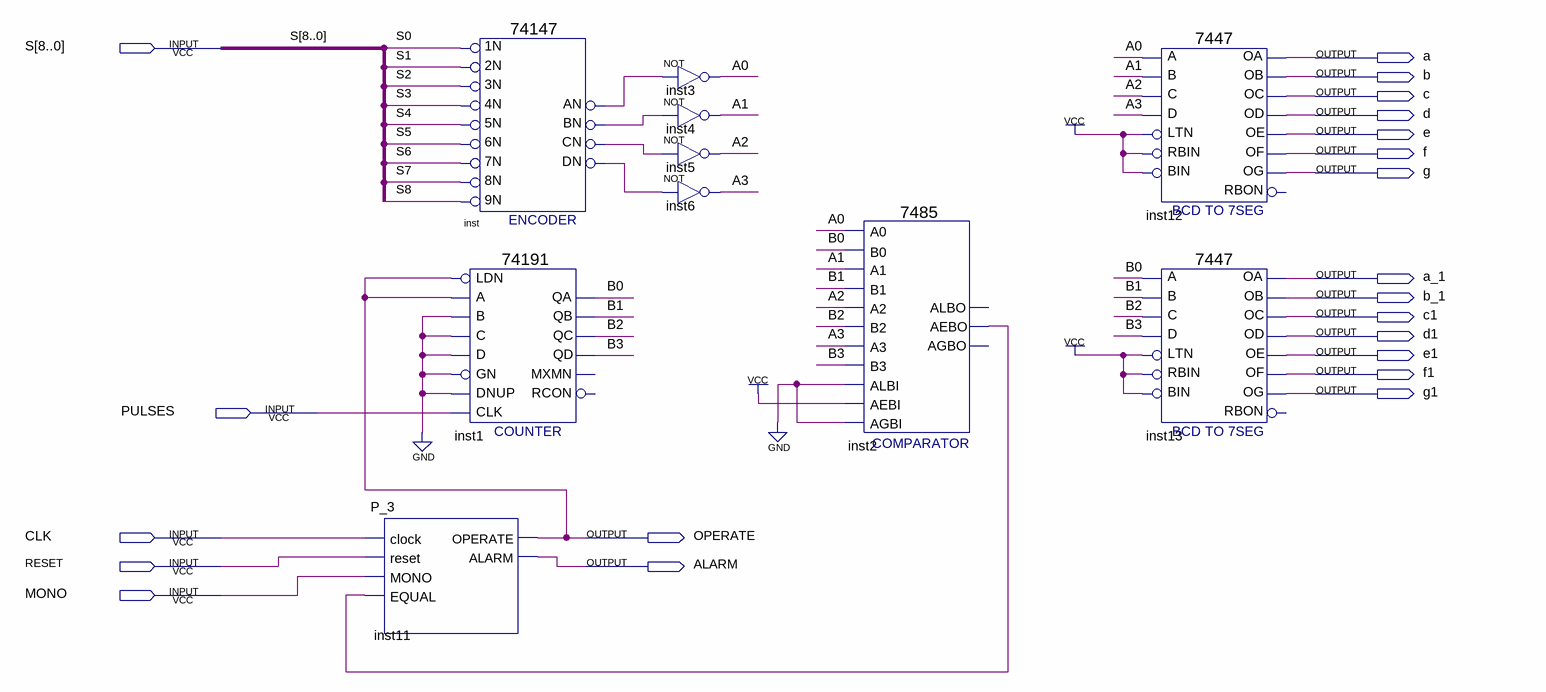
[diagram p0: schematic sheet]
// Quartus schematic Practica_3.bdf as structural Verilog: 10 symbols, 21 pins
module Practica_3 (
  input  [8:0] S,
  input  PULSES,
  input  CLK,
  input  RESET,
  input  MONO,
  output a,
  output b,
  output c,
  output d,
  output e,
  output f,
  output g,
  output a_1,
  output b_1,
  output c1,
  output d1,
  output e1,
  output f1,
  output g1,
  output OPERATE,
  output ALARM
);

  wire A0, A1, A2, A3, B0, B1, B2, B3, inst2_aebo, inst_an, inst_bn, inst_cn, inst_dn;

  P_3 inst11 (.clock(CLK), .reset(RESET), .MONO(MONO), .EQUAL(inst2_aebo), .OPERATE(OPERATE), .ALARM(ALARM));
  \74147  inst (
    .\1N (S[0]), .\2N (S[1]), .\3N (S[2]), .\6N (S[5]), .\5N (S[4]), .\4N (S[3]), .\9N (S[8]), .\8N (S[7]),
    .\7N (S[6]), .CN(inst_cn), .BN(inst_bn), .AN(inst_an), .DN(inst_dn));
  \74191  inst1 (
    .LDN(OPERATE), .D(1'b0), .C(1'b0), .B(1'b0), .A(OPERATE), .CLK(PULSES), .DNUP(1'b0), .GN(1'b0), .QA(B0),
    .QB(B1), .QD(B3), .QC(B2));  // open: RCON, MXMN
  not inst3 (A0, inst_an);
  not inst4 (A1, inst_bn);
  not inst5 (A2, inst_cn);
  not inst6 (A3, inst_dn);
  \7485  inst2 (
    .A3(A3), .B2(B2), .A2(A2), .AEBI(1'b1), .AGBI(1'b0), .ALBI(1'b0), .A0(A0), .B0(B0), .B3(B3), .A1(A1),
    .B1(B1), .AEBO(inst2_aebo));  // open: ALBO, AGBO
  \7447  inst12 (
    .LTN(1'b1), .B(A1), .C(A2), .D(A3), .RBIN(1'b1), .BIN(1'b1), .A(A0), .OB(b), .OC(c), .OE(e), .OD(d),
    .OF(f), .OG(g), .OA(a));  // open: RBON
  \7447  inst13 (
    .LTN(1'b1), .B(B1), .C(B2), .D(B3), .RBIN(1'b1), .BIN(1'b1), .A(B0), .OB(b_1), .OC(c1), .OE(e1), .OD(d1),
    .OF(f1), .OG(g1), .OA(a_1));  // open: RBON
endmodule
